# EAGLE design Smartbox (EAGLE 9.5.2)
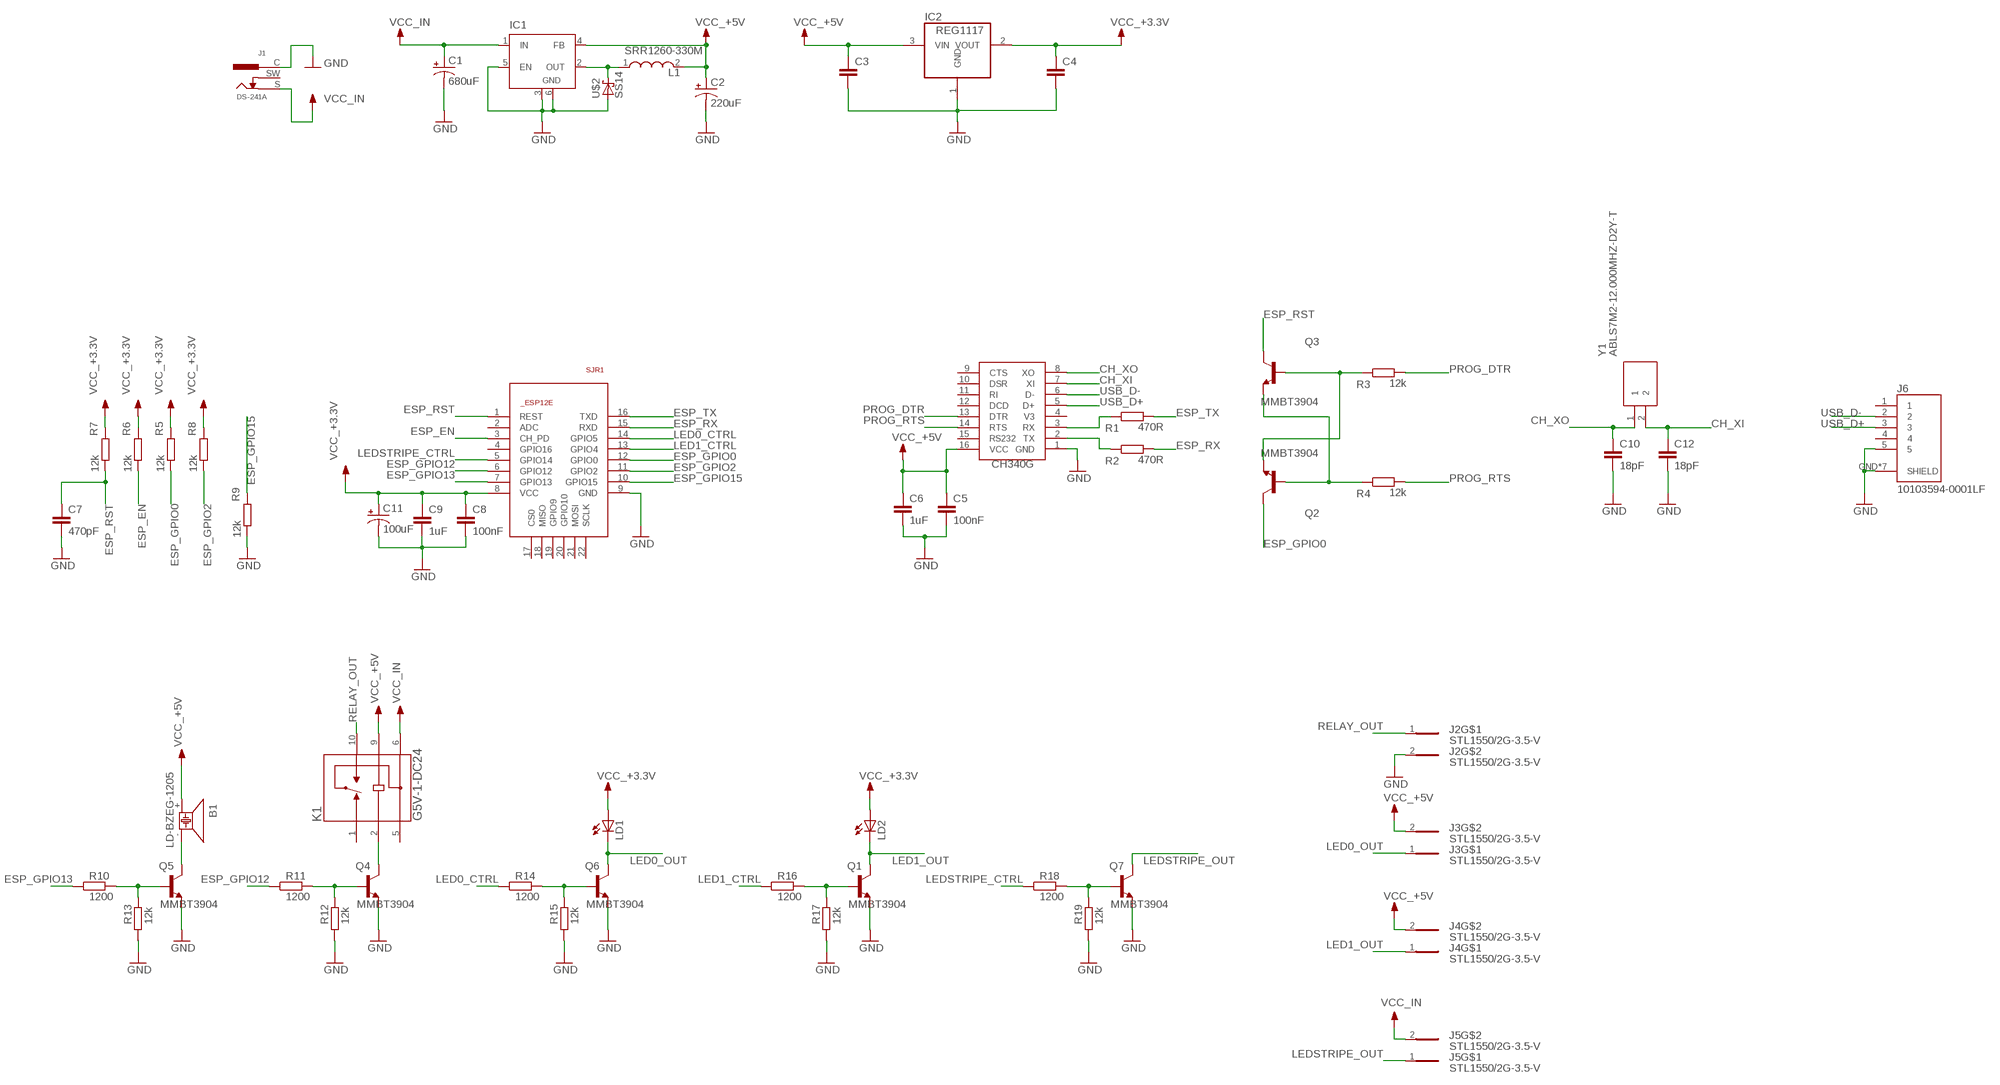
[diagram p0: schematic, sheet 1]

## Parts
B1  LD-BZEG-1205  [LD-BZEG-12XX]
C1  680uF  100UF-POLAR-25V-20%(ELEC)  [PANASONIC_D]
C2  220uF  100UF-POLAR-25V-20%(ELEC)  [PANASONIC_D]
C3  C-EUC0805  [C0805]
C4  C-EUC0805  [C0805]
C5  100nF  C-EUC0805  [C0805]
C6  1uF  C-EUC0805  [C0805]
C7  470pF  C-EUC0805  [C0805]
C8  100nF  C-EUC0805  [C0805]
C9  1uF  C-EUC0805  [C0805]
C10  18pF  C-EUC0805  [C0805]
C11  100uF  100UF-POLAR-25V-20%(ELEC)  [PANASONIC_D]
C12  18pF  C-EUC0805  [C0805]
IC1  LM2596S  [TO263-5]
IC2  REG1117  [SOT223]
J1  DS-241A  [DS-241]
J2  STL1550/2G-3.5-V  [STL1550/2G-3.5-V-GREEN]
J3  STL1550/2G-3.5-V  [STL1550/2G-3.5-V-GREEN]
J4  STL1550/2G-3.5-V  [STL1550/2G-3.5-V-GREEN]
J5  STL1550/2G-3.5-V  [STL1550/2G-3.5-V-GREEN]
J6  10103594-0001LF  [10103594-0001LF]
K1  G5V-1-DC24  [G5V-1-DC24]
L1  SRR1260-330M  [SRR1260-150M]
LD1  LEDCHIPLED_0805  [CHIPLED_0805]
LD2  LEDCHIPLED_0805  [CHIPLED_0805]
Q1  MMBT3904  [SOT23]
Q2  MMBT3904  [SOT23]
Q3  MMBT3904  [SOT23]
Q4  MMBT3904  [SOT23]
Q5  MMBT3904  [SOT23]
Q6  MMBT3904  [SOT23]
Q7  MMBT3904  [SOT23]
R1  470R  R-EU_R0805  [R0805]
R2  470R  R-EU_R0805  [R0805]
R3  12k  R-EU_R0805  [R0805]
R4  12k  R-EU_R0805  [R0805]
R5  12k  R-EU_R0805  [R0805]
R6  12k  R-EU_R0805  [R0805]
R7  12k  R-EU_R0805  [R0805]
R8  12k  R-EU_R0805  [R0805]
R9  12k  R-EU_R0805  [R0805]
R10  1200  R-EU_R0805  [R0805]
R11  1200  R-EU_R0805  [R0805]
R12  12k  R-EU_R0805  [R0805]
R13  12k  R-EU_R0805  [R0805]
R14  1200  R-EU_R0805  [R0805]
R15  12k  R-EU_R0805  [R0805]
R16  1200  R-EU_R0805  [R0805]
R17  12k  R-EU_R0805  [R0805]
R18  1200  R-EU_R0805  [R0805]
R19  12k  R-EU_R0805  [R0805]
SJR1  ESP8266-12EESP12E  [ESP8266-ESP12E]
U$2  SS14  [DO-214AC]
U$3  CH340G  [SOIC16]
Y1  ABLS7M2-12.000MHZ-D2Y-T  ABLS7M2-16.000MHZ-D2Y-T  [ABLS7M216000MHZD2YT]

## Nets
CH_XI: C12.1 U$3.7(XI) Y1.2
CH_XO: C10.1 U$3.8(XO) Y1.1
ESP_EN: R6.2 SJR1.3(CH_PD)
ESP_GPIO0: Q2.3(C) R5.2 SJR1.12(GPIO0)
ESP_GPIO2: R8.2 SJR1.11(GPIO2)
ESP_GPIO12: R11.1 SJR1.6(GPIO12)
ESP_GPIO13: R10.1 SJR1.7(GPIO13)
ESP_GPIO15: R9.1 SJR1.10(GPIO15)
ESP_RST: C7.1 Q3.3(C) R7.2 SJR1.1(REST)
ESP_RX: R2.2 SJR1.15(RXD)
ESP_TX: R1.2 SJR1.16(TXD)
GND: C1.- C2.- C3.2 C4.2 C5.2 C6.2 C7.2 C8.2 C9.2 C10.2 C11.- C12.2 IC1.3(GND) IC1.5(EN) IC1.6(GND) IC2.1(GND) J1.C J2.2 J6.5 J6.GND$1(SHIELD) J6.GND$2(SHIELD) J6.GND(SHIELD) J6.S1(SHIELD) J6.S2(SHIELD) J6.S3(SHIELD) J6.S4(SHIELD) Q1.2(E) Q4.2(E) Q5.2(E) Q6.2(E) Q7.2(E) R9.2 R12.1 R13.1 R15.1 R17.1 R19.1 SJR1.9(GND) U$2.A U$3.1(GND)
LED0_CTRL: R14.1 SJR1.14(GPIO5)
LED0_OUT: J3.1 LD1.C Q6.3(C)
LED1_CTRL: R16.1 SJR1.13(GPIO4)
LED1_OUT: J4.1 LD2.C Q1.3(C)
LEDSTRIPE_CTRL: R18.1 SJR1.5(GPIO14)
LEDSTRIPE_OUT: J5.1 Q7.3(C)
N$1: R1.1 U$3.3(RX)
N$2: R2.1 U$3.2(TX)
N$3: Q2.2(E) Q3.1(B) R3.1
N$4: Q2.1(B) Q3.2(E) R4.1
N$5: K1.2 Q4.3(C)
N$6: Q5.1(B) R10.2 R13.2
N$7: B1.- Q5.3(C)
N$8: Q1.1(B) R16.2 R17.2
N$9: Q4.1(B) R11.2 R12.2
N$10: Q6.1(B) R14.2 R15.2
N$11: Q7.1(B) R18.2 R19.2
N$23: IC1.2(OUT) L1.1 U$2.C
PROG_DTR: R3.2 U$3.13(DTR)
PROG_RTS: R4.2 U$3.14(RTS)
RELAY_OUT: J2.1 K1.10
USB_D+: J6.3 U$3.5(D+)
USB_D-: J6.2 U$3.6(D-)
VCC_+3.3V [power]: C4.1 C8.1 C9.1 C11.+ IC2.2(VOUT) LD1.A LD2.A R5.1 R6.1 R7.1 R8.1 SJR1.8(VCC)
VCC_+5V [power]: B1.+ C2.+ C3.1 C5.1 C6.1 IC1.4(FB) IC2.3(VIN) J3.2 J4.2 K1.9 L1.2 U$3.16(VCC)
VCC_IN [power]: C1.+ IC1.1(IN) J1.S J5.2 K1.6
Unconnected: J1.SW J6.1 J6.4 K1.1 K1.5 SJR1.2(ADC) SJR1.4(GPIO16) SJR1.17(CS0) SJR1.18(MISO) SJR1.19(GPIO9) SJR1.20(GPIO10) SJR1.21(MOSI) SJR1.22(SCLK) U$3.4(V3) U$3.9(CTS) U$3.10(DSR) U$3.11(RI) U$3.12(DCD) U$3.15(RS232)

## Library data of the parts
B1 = buzzer:LD-BZEG-1205: Loudity Piezo Buzzer, 2.3 kHz, 3-7 Vdc, 85 dB
C1 C2 = SparkFun-Capacitors:100UF-POLAR: 100µF polarized capacitors A capacitor is a passive two-terminal electrical component used to store electrical energy temporarily in an electric field.; PROD_ID: CAP-12547; VALUE: 100uF
C3-C10 C12 = rcl:C-EU: CAPACITOR, European symbol; SPICEPREFIX: C
C11 = SparkFun-Capacitors:100UF-POLAR: 100µF polarized capacitors A capacitor is a passive two-terminal electrical component used to store electrical energy temporarily in an electric field.; PROD_ID: CAP-12547
IC1 = linear:LM2596S: STEP-DOWN VOLTAGE REGULATOR
IC2 = burr-brown:REG1117: 800mA and 1A Low Dropout (LDO) Positive Regulator 1.8V, 2.5V, 2.85V, 3.3V, 5V, and Adj; MPN: REG1117; OC_FARNELL: 1097566; OC_NEWARK: 14P6981
J1 = Jack-connectors:DS-241: DC POWER JACK Model number DS-241X where X defines diameter of center pin X letter Diameter of center pin A 2.5 mm B 2.0 mm C 2.35 mm G 3.0 mm; DESCRIPTION: Power supply connector, 2.5 mm center pin; PACK: DS-241
J2-J5 = con-ptr:STL1550/2G-3.5-V
J6 = Jack-connectors:10103594-0001LF: CONN RCPT USB2.0 MICRO B SMD R/A Manufacturer's datasheet <https://cdn.amphenol-icc.com/media/wysiwyg/files/drawing/10103594.pdf>; CREATED_BY: PCBLayout.com; DIGIKEY_PART_NUMBER: 609-4050-2-ND; MANUFACTURER: Amphenol ICC (FCI); MPN: 10103594-0001LF
K1 = Relay:G5V-1-DC24: RELAY GEN PURPOSE SPDT 1A 24VDC Manufacturer's datasheet <https://omronfs.omron.com/en_US/ecb/products/pdf/en-g5v_1.pdf>; CREATED_BY: PCBLayout.com; DIGIKEY_PN: Z775-ND; MANUFACTURER: Omron Electronics Inc-EMC Div; MPN: G5V-1-DC24
L1 = SRR1260-330M:SRR1260-330M: Power inductor SMD shielded 33uH Bourns SRR1260 Series Shielded Wire-wound SMD Inductor with a Ferrite Core, 33 uH +/-20% Wire-Wound 3A Idc Q:27 Source: Datasheet <https://componentsearchengine.com/Datasheets/1/SRR1260-330M.pdf>; DESCRIPTION: Power inductor SMD shielded 33uH Bourns SRR1260 Series Shielded Wire-wound SMD Inductor with a Ferrite Core, 33 uH +/-20% Wire-Wound 3A Idc Q:27; HEIGHT: mm; MANUFACTURER_NAME: Bourns; MANUFACTURER_PART_NUMBER: SRR1260-330M; MOUSER_PART_NUMBER: 652-SRR1260-330M; MOUSER_PRICE-STOCK: https://www.mouser.com/Search/Refine.aspx?Keyword=652-SRR1260-330M
LD1 LD2 = led:LED: LED OSRAM: - CHIPLED LG R971, LG N971, LY N971, LG Q971, LY Q971, LO R971, LY R971 LH N974, LH R974 LS Q976, LO Q976, LY Q976 LO Q996 - Hyper CHIPLED LW Q18S LB Q993, LB Q99A, LB R99A - SideLED LS A670, LO A670, LY A670, LG A670, LP A670 LB A673, LV A673, LT A673, LW A673 LH A674 LY A675 LS A676, LA A676, LO A676, LY A676, LW A676 LS A679, LY A679, LG A679 - Hyper Micro SIDELED® LS Y876, LA Y876, LO Y876, LY Y876 LT Y87S - SmartLED LW L88C, LW L88S LB L89C, LB L89S, LG L890 LS L89K, LO L89K, LY L89K LS L896, LA L896, LO L896, LY L896 - TOPLED LS T670, LO T670, LY T670, LG T670, LP T670 LSG T670, LSP T670, LSY T670, LOP T670, LYG T670 LG T671, LOG T671, LSG T671 LB T673, LV T673, LT T673, LW T673 LH T674 LS T676, LA T676, LO T676, LY T676, LB T676, LH T676, LSB T676, LW T676 LB T67C, LV T67C, LT T67C, LS T67K, LO T67K, LY T67K, LW E67C LS E67B, LA E67B, LO E67B, LY E67B, LB E67C, LV E67C, LT E67C LW T67C LS T679, LY T679, LG T679 LS T770, LO T770, LY T770, LG T770, LP T770 LB T773, LV T773, LT T773, LW T773 LH T774 LS E675, LA E675, LY E675, LS T675 LS T776, LA T776, LO T776, LY T776, LB T776 LHGB T686 LT T68C, LB T68C - Hyper Mini TOPLED® LB M676 - Mini TOPLED Santana® LG M470 LS M47K, LO M47K, LY M47K Source: http://www.osram.convergy.de/
Q1-Q7 = Transistor:MMBT3904: TRANS NPN 40V 0.2A SOT-23 Manufacturer's datasheet <https://www.onsemi.com/pub/Collateral/PZT3904-D.pdf>; CREATED_BY: PCBLayout.com; DIGIKEY_PART_NUMBER: MMBT3904FSCT-ND; MANUFACTURER: ON Semiconductor; MPN: MMBT3904; PACKAGE: SOT-23-3
R1-R19 = rcl:R-EU_: RESISTOR, European symbol; SPICEPREFIX: R
SJR1 = esp12e:ESP8266-12E: ESP8266-12E Library for Eagle CAD The author not responsible for any damages or errors!. Created by Suhail jr.lt;/author>
U$2 = SS14:SS14; AVAILABILITY: Unavailable; DESCRIPTION: Diode Schottky 40V 1A Surface Mount SMA _DO-214AC_; MF: ON Semiconductor; MP: SS14; PACKAGE: DO-214 Fairchild Semiconductor; PRICE: None
U$3 = ch340g:CH340G
Y1 = ABLS7M2-16MHZ-D2Y-T:ABLS7M2-16.000MHZ-D2Y-T: Crystals Source: Datasheet <https://abracon.com/Resonators/ABLS7M2.pdf>; DESCRIPTION: Crystals; HEIGHT: 2mm; MANUFACTURER_NAME: ABRACON; MANUFACTURER_PART_NUMBER: ABLS7M2-16.000MHZ-D2Y-T; MOUSER_PART_NUMBER: 815-ABLS7M216MHZD2YT; MOUSER_PRICE-STOCK: https://www.mouser.com/Search/Refine.aspx?Keyword=815-ABLS7M216MHZD2YT

## Net classes
1 power: width 0.5 mm

## Board
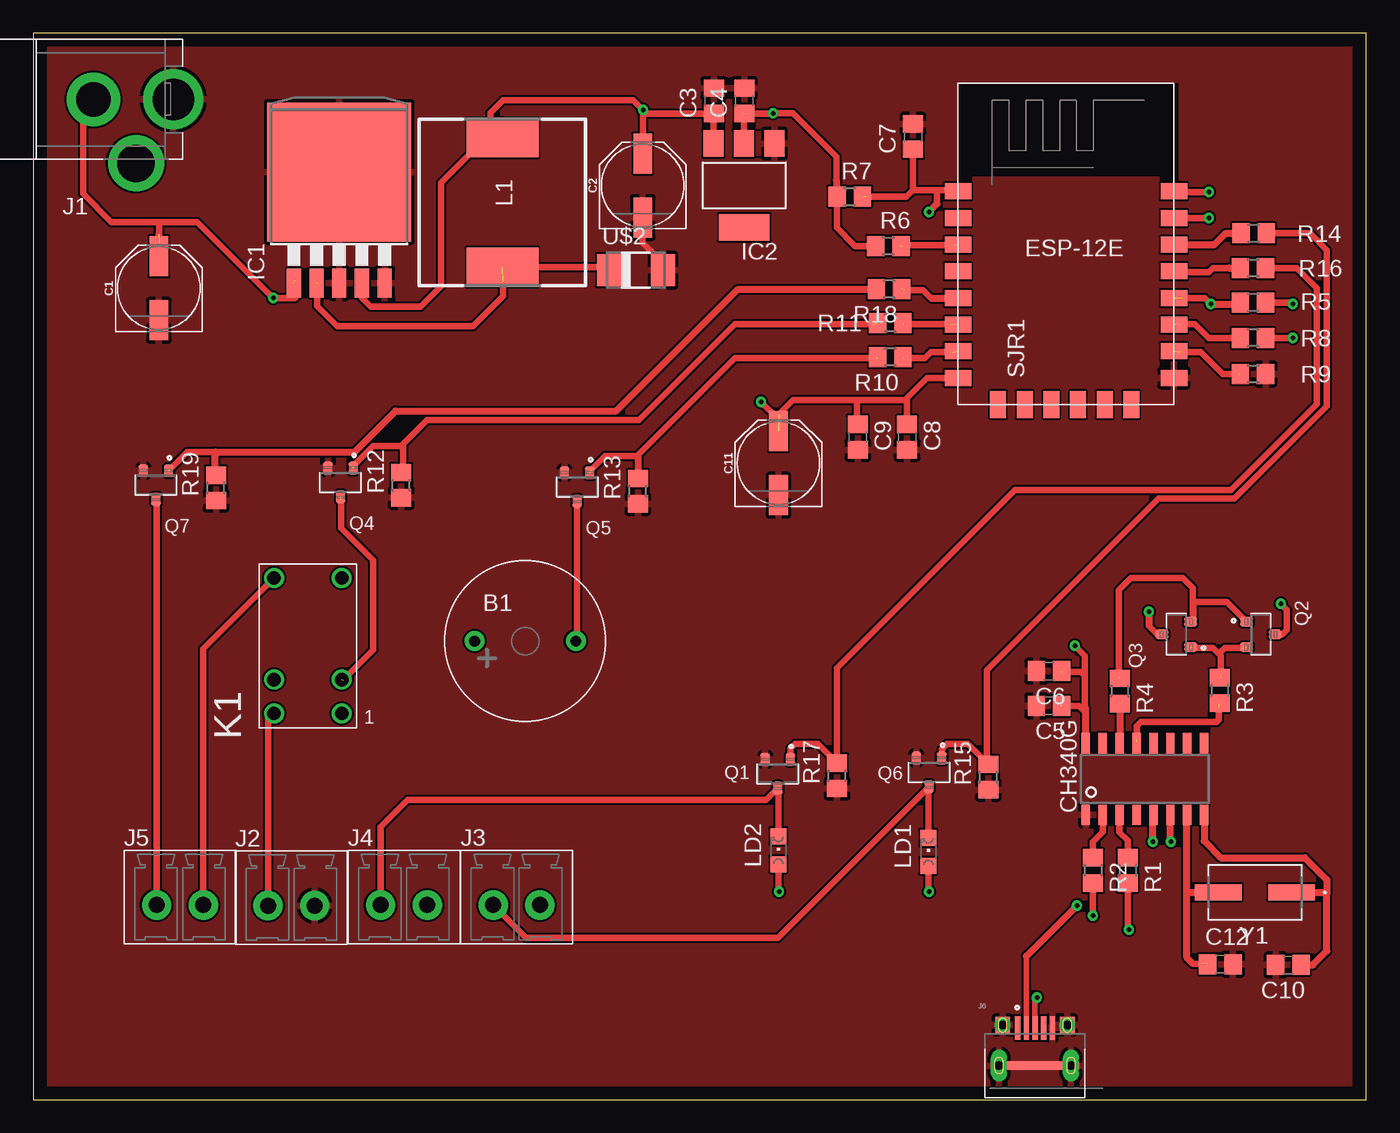
[diagram p1: board, top side]
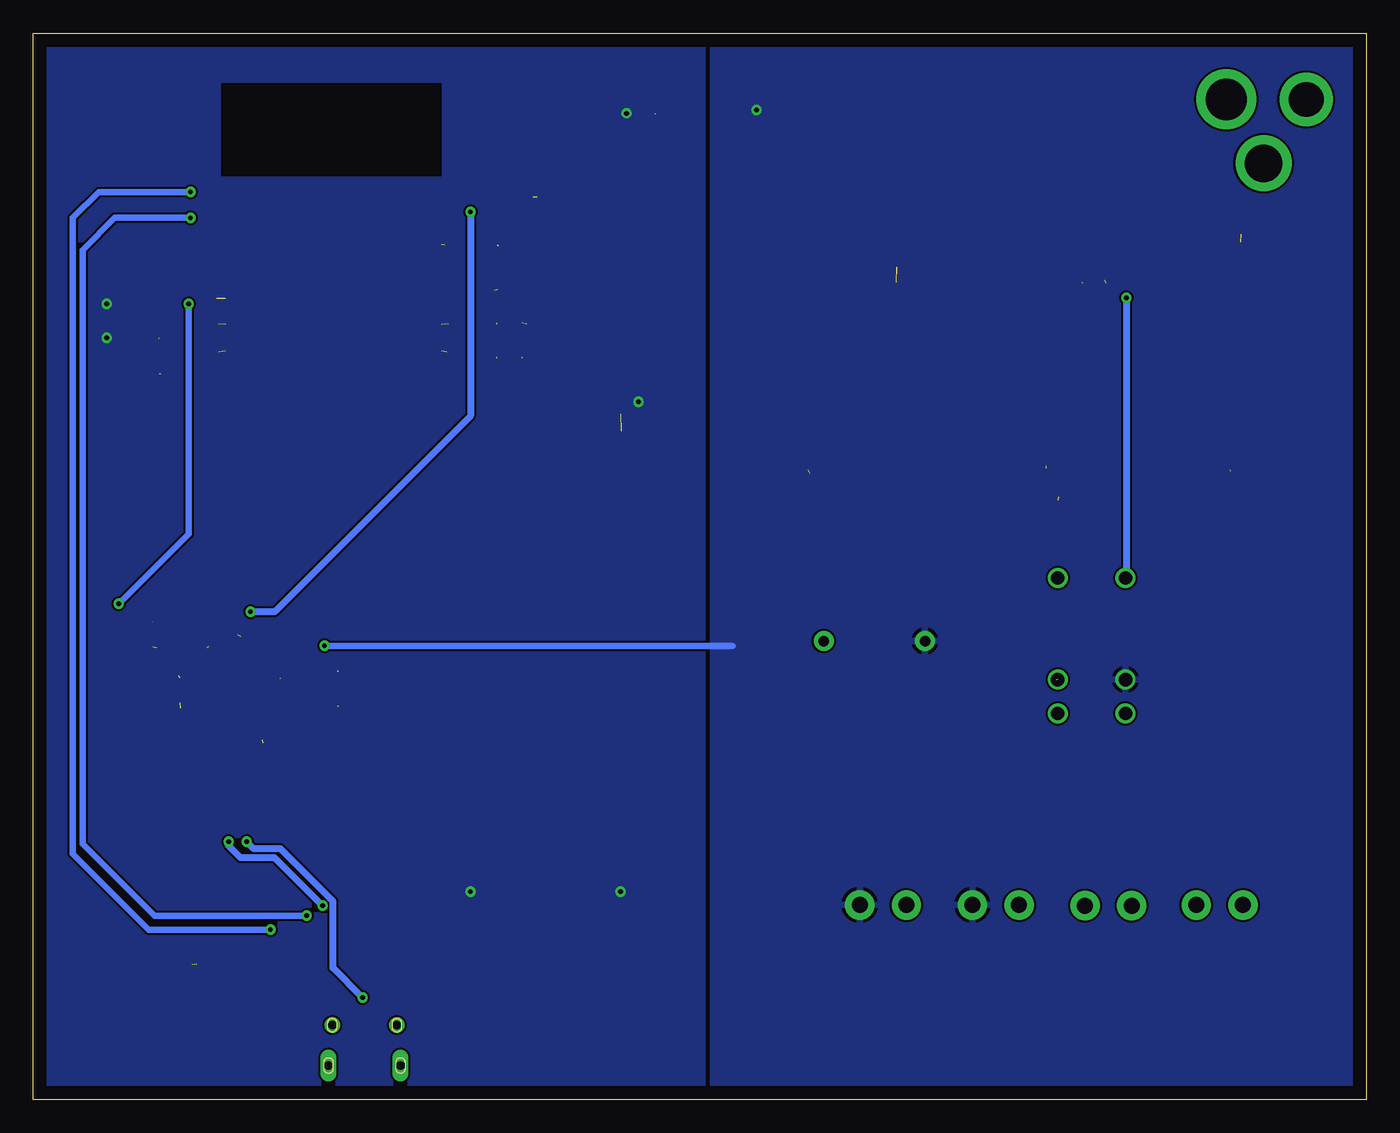
[diagram p2: board, bottom side, seen from below]

Size 100 x 80 mm. Coordinates in mm from the lower left corner, seen from the top.
Outline: 0,0 100,0 100,80 0,80 0,0
Copper layers (1*16): Top 0.035mm / dielectric 1.5mm / Bottom 0.035mm
Design rules "default": minimum track width 6mil, minimum drill 0.35mm, track to track 6mil, track to pad 6mil, pad to pad 6mil, via to via 6mil, smd to smd 6mil, copper to edge 40mil, drill to drill 6mil, minimum pad ring 10mil, minimum via ring 8mil, stop-mask expansion 4mil, vias tented up to drill 0mil, thermal gap 10mil

### Footprints (pad centres in the part's own frame; a part is rotated, then mirrored left to right if it is on the bottom)
LD-BZEG-12XX = drill 0.8 pad 1.5: + -3.8,0; - 3.8,0
PANASONIC_D = smd 3 x 1.4: + 2.4,0; - -2.4,0
C0805 = smd 1.3 x 1.5: 1 -0.95,0; 2 0.95,0
TO263-5 = smd 1.067 x 2.159: 1 -3.404,-5.791; 2 -1.702,-5.791; 3 0,-5.791; 4 1.702,-5.791; 5 3.404,-5.791 | smd 10.8 x 10.41: 6 0,2.54
SOT223 = smd 1.499 x 2.007: 1 -2.261,-3.15; 2 0.025,-3.15; 3 2.311,-3.15 | smd 3.81 x 2.007: 4 0,3.15
DS-241 = drill 3.1 pad 4.5: C -2.8,0 | drill 2.6 pad 4: S 3.2,0 | drill 2.8 pad 4.2: SW 0,4.8
STL1550/2G-3.5-V-GREEN = drill 1.2 pad 2.2: 1 -1.75,0; 2 1.75,0
10103594-0001LF = smd 0.4 x 1.75: 1 -1.3,2.825; 2 -0.65,2.825; 3 0,2.825; 4 0.65,2.825; 5 1.3,2.825 | smd 6.613 x 0.635: GND 0,0 | smd 1.1 x 1.2: GND$1 -2.425,3.05; GND$2 2.425,3.05 | drill 0.65 pad 1.05: S1 -2.425,3.03; S2 2.425,3.03 | drill 0.66 pad 1.2 long: S3 -2.705,0; S4 2.705,0
G5V-1-DC24 = drill 1 pad 1.5: 1 -5.08,-2.54; 2 -2.54,-2.54; 5 5.08,-2.54; 6 5.08,2.54; 9 -2.54,2.54; 10 -5.08,2.54
SRR1260-150M = smd 2.9 x 5.4: 1 -4.85,0; 2 4.85,0
CHIPLED_0805 = smd 1.2 x 1.2: A 0,-1.05; C 0,1.05
SOT23 = smd 0.71 x 0.96: 1 -0.95,-1.075; 2 0.95,-1.075; 3 0,1.075
R0805 = smd 1.3 x 1.5: 1 -0.95,0; 2 0.95,0
ESP8266-ESP12E = smd 2 x 1.2: 1 -7.62,5.84; 2 -7.62,3.84; 3 -7.62,1.84; 4 -7.62,-0.16; 5 -7.62,-2.16; 6 -7.62,-4.16; 7 -7.62,-6.16; 8 -7.62,-8.16; 9 8.58,-8.16; 10 8.58,-6.16; 11 8.58,-4.16; 12 8.58,-2.16; 13 8.58,-0.16; 14 8.58,1.84; 15 8.58,3.84; 16 8.58,5.84 | smd 1.2 x 2: 17 -4.62,-10.16; 18 -2.62,-10.16; 19 -0.62,-10.16; 20 1.38,-10.16; 21 3.38,-10.16; 22 5.38,-10.16
DO-214AC = smd 1.8 x 2.4: A 2.025,0; C -2.025,0
SOIC16 = smd 0.635 x 1.524: 1 -4.445,-2.695; 2 -3.175,-2.695; 3 -1.905,-2.695; 4 -0.635,-2.695; 5 0.635,-2.695; 6 1.905,-2.695; 7 3.175,-2.695; 8 4.445,-2.695; 9 4.445,2.695; 10 3.175,2.695; 11 1.905,2.695; 12 0.635,2.695; 13 -0.635,2.695; 14 -1.905,2.695; 15 -3.175,2.695; 16 -4.445,2.695
ABLS7M216000MHZD2YT = smd 3.5 x 1.2: 1 -2.75,0; 2 2.75,0

### Placement (x,y rotation side)
B1  36.9,34.4 0 top
C1  9.42,60.87 90 top
C2  45.72,68.58 90 top
C3  51.05,74.93 90 top
C4  53.34,74.93 90 top
C5  76.2,29.55 180 top
C6  76.2,32.15 180 top
C7  66,72.25 90 top
C8  65.55,49.7 270 top
C9  61.85,49.7 270 top
C10  94.15,10.1 180 top
C11  55.9,47.75 90 top
C12  89.05,10.15 0 top
IC1  22.95,67.05 0 top
IC2  53.34,68.58 180 top
J1  7.7,75.05 180 top
J2  19.35,14.55 0 top
J3  36.25,14.6 0 top
J4  27.8,14.6 0 top
J5  11,14.6 0 top
J6  75.15,2.55 0 top
K1  20.6,34.05 90 top
L1  35.19,67.31 90 top
LD1  67.15,18.6 0 top
LD2  55.9,18.7 0 top
Q1  55.85,24.45 180 top
Q2  92.1,34.9 270 top
Q3  85.75,34.9 90 top
Q4  23.05,46.3 180 top
Q5  40.8,45.95 180 top
Q6  67.2,24.55 180 top
Q7  9.2,46.1 180 top
R1  82.1,17.2 270 top
R2  79.5,17.2 270 top
R3  89,30.7 270 top
R4  81.5,30.65 270 top
R5  91.5,59.8 180 top
R6  64.15,64.05 0 top
R7  61.25,67.75 0 top
R8  91.5,57.15 180 top
R9  91.5,54.45 0 top
R10  64.3,55.7 180 top
R11  64.3,58.25 180 top
R12  27.6,46.1 90 top
R13  45.35,45.65 90 top
R14  91.55,65 0 top
R15  71.65,24.2 90 top
R16  91.5,62.4 0 top
R17  60.3,24.3 90 top
R18  64.2,60.8 180 top
R19  13.7,45.9 90 top
SJR1  77,62.3 0 top
U$2  45.2,62.23 0 top
U$3  83.4,24.05 0 top
Y1  91.65,15.55 180 top

### Tracks (layer width: path | path; a pad name or v marks a point on that pad's centre or on a via)
CH_XI  (1 unrouted)
  Top 0.5: 87.75,10.2 87,10.2
  Top 0.508: U$3.7 86.55,21.33 86.55,15.45 | 87,10.2 86.55,10.65 86.55,15.45 | 86.55,15.45 86.65,15.55 Y1.2
CH_XO
  Top 0.508: C10.1 96,10.1 97.05,11.15 97.05,15.45 | Y1.1 96.95,15.55 97.05,15.45 | U$3.8 87.84,19.41 89.1,18.15 95.4,18.15 97.05,16.5 97.05,15.45
ESP_EN  (2 unrouted)
  Top 0.5: 65.15,64.1 69.15,64.1
ESP_GPIO0  (via drill 0.35)  (1 unrouted)
  Top 0.5: 86.25,60.15 87.9,60.15 v88.35,59.7 | Q2.3 93.7,34.9 94.05,35.25 94.05,36.75 v93.6,37.2
  Top 0.508: v88.35,59.7 90.45,59.7 R5.2
  Bottom 0.5: v93.6,37.2 88.35,42.45 v88.35,59.7
ESP_GPIO2  (2 unrouted)
  Top 0.5: 86.1,58.2 87.15,58.2 88.2,57.15 90.6,57.15
ESP_GPIO12  (2 unrouted)
  Top 0.5: 68.85,58.2 65.25,58.2
ESP_GPIO13  (2 unrouted)
  Top 0.5: 69,56.1 67.35,56.1 66.9,55.65 66.3,55.65 65.25,55.65
ESP_GPIO15  (2 unrouted)
  Top 0.5: 86.1,56.1 87.6,56.1 89.25,54.45 90.45,54.45
ESP_RST  (via drill 0.35)  (2 unrouted)
  Top 0.5: 66,71 66,68.25 | 66,68.25 67.8,68.25 | 68.75,68.25 67.8,68.25 | 62.5,67.75 65.5,67.75 66,68.25 | 67.8,68.25 67.8,67.2 | 83.7,35.55 84.45,34.8
  Top 0.508: 67.8,67.2 v67.2,66.6 | v83.7,36.6 83.7,35.55 | C7.1 66,71 | SJR1.1 68.86,68.14 68.75,68.25
  Bottom 0.508: v67.2,66.6 67.2,51.3 81.9,36.6 v83.7,36.6
ESP_RX  (via drill 0.35)
  Top 0.5: R2.2 v79.5,13.8 | v88.2,66.15 v88.19,66.14 SJR1.15
  Bottom 0.5: v79.5,13.8 90.9,13.8 96.3,19.2 96.3,63.75 93.9,66.15 v88.2,66.15
ESP_TX  (via drill 0.35)
  Top 0.5: R1.2 82.1,12.85 v82.2,12.75 | v88.2,68.1 85.62,68.1 SJR1.16
  Bottom 0.5: v82.2,12.75 91.35,12.75 97.05,18.45 97.05,66.15 95.1,68.1 v88.2,68.1
GND
  Top 0.5: U$2.A 47.23,62.77 45.72,64.28 C2.-
  pour Top: 0.25,79.75 99.75,79.75 99.75,0.4 0.25,0.4
LED0_CTRL
  Top 0.508: 85.67,64.05 SJR1.14 88.59,64.14 89.45,65 R14.1
LED0_OUT
  Top 0.5: 67.09,23.36 55.88,12.15 36.95,12.15 J3.1 | 67.09,23.36 Q6.3 | LD1.C 67.15,23.3 67.09,23.36
LED1_CTRL
  Top 0.5: 86.1,62.1 88.2,62.1 88.5,62.4 89.7,62.4
  Top 0.508: SJR1.13 86.06,62.14 86.1,62.1 | 89.7,62.4 R16.1
LED1_OUT
  Top 0.5: J4.1 26.05,20.45 28.07,22.48 54.95,22.48 Q1.3 55.9,23.32 LD2.C
LEDSTRIPE_CTRL  (1 unrouted)
  Top 0.5: 67.35,60.15 66.75,60.75 65.4,60.75
  Top 0.508: 67.35,60.15 67.36,60.14 SJR1.5
LEDSTRIPE_OUT
  Top 0.5: J5.1 9.25,44.98 Q7.3
N$1
  Top 0.5: R1.1 82.1,19.45 81.5,20.05 U$3.3
N$2
  Top 0.5: R2.1 79.5,19.35 80.25,20.1 80.25,21.33 U$3.2
N$3  (3 unrouted)
  Top 0.5: 89.1,31.8 89.1,33.3 88.95,33.45 88.5,33.9 87,33.9 | 89.1,33.6 89.4,33.9 90.75,33.9
  Top 0.508: 88.95,33.45 89.1,33.6
N$4  (2 unrouted)
  Top 0.5: 81.45,31.65 81.45,38.25 82.35,39.15 86.25,39.15 87,38.4 87,37.35 89.55,37.35 91.05,35.85
  Top 0.508: 87,37.35 87,36.02 Q3.2
N$5  (2 unrouted)
  Top 0.5: 23.1,45 23.1,42.9 25.5,40.5 25.5,33.75 23.25,31.5
N$6  (2 unrouted)
  Top 0.5: 63.3,55.65 52.65,55.65 45.3,48.3 42.9,48.3 41.85,47.25
  Top 0.508: 45.3,48.3 45.35,48.25 R13.2
N$7
  Top 0.5: Q5.3 40.8,34.5 B1.-
N$8
  Top 0.5: R16.2 94.8,62.4 96.3,60.9 96.3,52.2 89.85,45.75 73.65,45.75 60.3,32.4 R17.2 58.85,26.7 57.15,26.7 56.8,26.35 Q1.1
N$9  (2 unrouted)
  Top 0.5: 63,58.2 52.65,58.2 45.45,51 29.55,51 27.75,49.2 27.75,49.05 | 27.75,47.1 27.75,49.05 | 27.75,49.05 25.5,49.05 24,47.55
  Top 0.508: R12.2 27.65,47.1 27.75,47.1
N$10
  Top 0.5: R14.2 95.8,65 97.05,63.75 97.05,52.03 90.12,45.1 84.4,45.1 71.55,32.25 71.55,25.25 R15.2 70.1,26.7 68.55,26.7 68.15,26.3 Q6.1
N$11  (1 unrouted)
  Top 0.5: 13.65,48.6 11.55,48.6 10.2,47.25
  Top 0.508: R18.2 52.85,60.8 52.8,60.75 43.71,51.66 27.18,51.66 24.12,48.6 13.65,48.6 13.65,46.9 R19.2
N$23  (2 unrouted)
  Top 0.5: L1.1 42.95,62.46 U$2.C | 21.3,61.35 21.3,59.55 22.8,58.05 33,58.05 35.25,60.3 35.25,61.35
PROG_DTR  (2 unrouted)
  Top 0.5: 82.8,27 82.8,28.05 83.1,28.35 88.8,28.35 88.95,28.5 88.95,29.4
PROG_RTS
  Top 0.508: R4.2 U$3.14
RELAY_OUT
  Top 0.5: J2.1 17.6,28.51 K1.10
USB_D+  (via drill 0.35)
  Top 0.406: J6.3 75.15,7.5
  Top 0.508: 75.15,7.5 v75.3,7.65 | v84,19.35 84,21.32 U$3.5
  Bottom 0.508: v84,19.35 83.46,18.81 81.45,18.81 77.52,14.88 77.52,9.87 v75.3,7.65
USB_D-  (via drill 0.35)
  Top 0.406: J6.2 74.5,10.75
  Top 0.508: 74.5,10.75 v78.3,14.55 | v85.35,19.35 85.31,19.39 U$3.6
  Bottom 0.508: v78.3,14.55 81.9,18.15 84.45,18.15 85.35,19.05 v85.35,19.35
VCC_+3.3V  (via drill 0.35)  (2 unrouted)
  Top 0.5: 53.31,73.95 IC2.2 | C4.1 55.48,73.98 v55.5,74 57,74 60.25,70.75 60.25,69 60.25,67.75 | SJR1.8 67.04,54.14 65.55,52.65 65.55,52.5 | 65.55,52.5 C8.1 | 65.55,52.5 61.8,52.5 | 61.8,52.5 61.8,50.7 C9.1 | 61.8,52.5 57,52.5 55.95,51.45 | C11.+ 55.9,51.05 v54.6,52.35 | R5.1 94.4,59.8 v94.5,59.7 | R8.1 v94.5,57.15 | LD1.A 67.15,15.65 v67.2,15.6 | LD2.A 55.9,15.65 v55.95,15.6 | R7.1 60.3,65.4 61.65,64.05 R6.1
  Top 0.508: 60.25,69 60.25,67.8 R7.1
  pour Bottom: 49.8,0.3 49.8,79.65 99.75,79.65 99.75,0.3
VCC_+5V  (via drill 0.35)  (2 unrouted)
  Top 0.5: L1.2 35.19,73.4 34.29,72.5 | 34.29,72.5 34.29,74.04 35.25,75 45,75 v45.75,74.25 | v45.75,74.25 45.75,71.01 C2.+ | IC2.3 51.03,73.95 C3.1 46.02,73.98 v45.75,74.25 | 34.29,72.5 30.6,68.81 30.6,61.05 29.05,59.5 25.3,59.5 24.65,60.15 IC1.4 | 78.9,31.8 78.9,29.4 78.9,29.1 78.45,29.55 77.1,29.55 | 78.9,31.8 78.6,32.1 77.1,32.1 | 78.9,31.8 78.9,33.3 v78.15,34.05
  Top 0.508: U$3.16 78.95,29.34 78.9,29.4
  Bottom 0.5: v78.15,34.05 47.55,34.05
  pour Bottom: 49,0.25 0.25,0.25 0.25,79.75 49,79.75
VCC_IN  (via drill 0.35)  (2 unrouted)
  Top 0.5: C1.+ 9.42,64.92 | 19.65,61.5 19.65,60.15 v18,60.15 12.3,65.85 9.45,65.85 | 9.45,65.85 9.45,64.35 | 9.45,65.85 5.85,65.85 3.75,67.95 3.75,74.3 J1.S | J5.2 12.75,33.82 K1.6
  Bottom 0.508: v18,60.15 18,39.19 K1.6